# Altium project dog_robot.PrjPcb
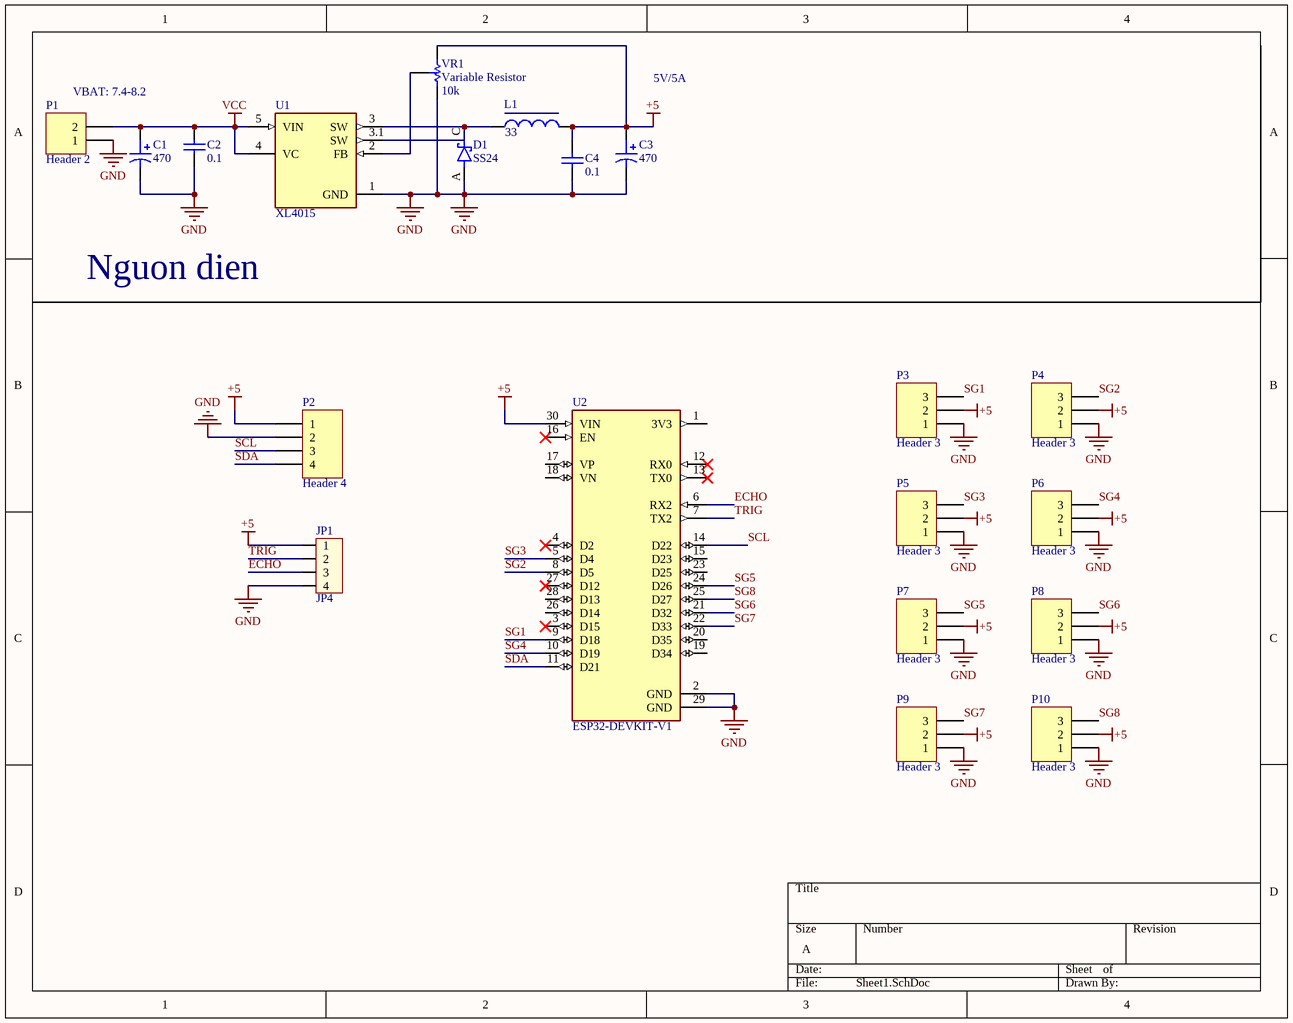
[diagram p0: Sheet1.SchDoc]
1 sheet, 20 parts. Net scope: global (net labels, ports and power ports of the same name join across sheets).
Board file: PCB1.PcbDoc

## Sheet Sheet1.SchDoc
size A; SheetNumber: 1; SheetTotal: 1

### Parts
C1  value 470  [RADIAL E]  (hidden comment: Cap Pol)
C2  value 0.1  [C-NP-0805]  (hidden comment: Cap Non-pol)
C3  value 470  [RADIAL E]  (hidden comment: Cap Pol)
C4  value 0.1  [C-NP-0805]  (hidden comment: Cap Non-pol)
D1  SS24  [DIOM5336X265N]
JP1  JP4  [CON4]
L1  33  [Cuon day ferrite]
P1  Header 2  [TBlock 2]
P2  Header 4  [Header 4]
P3  Header 3  [Header 3]
P4  Header 3  [Header 3]
P5  Header 3  [Header 3]
P6  Header 3  [Header 3]
P7  Header 3  [Header 3]
P8  Header 3  [Header 3]
P9  Header 3  [Header 3]
P10  Header 3  [Header 3]
U1  XL4015  [CONV_XL4015]
U2  ESP32-DEVKIT-V1  [MODULE_ESP32_DEVKIT_V1]
VR1  Variable Resistor  value 10k  [VRes-R]

### Nets
+5: C3.1 C4.1 JP1.1 L1.2 P2.1 P3.2 P4.2 P5.2 P6.2 P7.2 P8.2 P9.2 P10.2 U2.30(VIN) VR1.1
GND: C1.2 C2.1 C3.2 C4.2 D1.A JP1.4 P1.1 P2.2 P3.1 P4.1 P5.1 P6.1 P7.1 P8.1 P9.1 P10.1 U1.1(GND) U2.2(GND) U2.29(GND) VR1.3
VCC: C1.1 C2.2 P1.2 U1.4(VC) U1.5(VIN)
ECHO: JP1.3 U2.6(RX2)
SCL: P2.3 U2.14(D22)
SDA: P2.4 U2.11(D21)
SG1: P3.3 U2.9(D18)
SG2: P4.3 U2.8(D5)
SG3: P5.3 U2.5(D4)
SG4: P6.3 U2.10(D19)
SG5: P7.3 U2.24(D26)
SG6: P8.3 U2.21(D32)
SG7: P9.3 U2.22(D33)
SG8: P10.3 U2.25(D27)
TRIG: JP1.2 U2.7(TX2)
NetD1_C: D1.C(K) L1.1 U1.3(SW) U1.3.1(SW)
NetU1_2: U1.2(FB) VR1.2

Not connected (* = marked no-connect by the designer): U2 1(3V3) 3(D15)* 4(D2)* 12(RX0)* 13(TX0)* 15(D23) 16(EN)* 17(VP) 18(VN) 19(D34) 20(D35) 23(D25) 26(D14) 27(D12)* 28(D13)

### Notes on the sheet
- VBAT: 7.4-8.2
- 5V/5A
- Nguon dien

### Library data of the parts
C1 C3 = Cap Pol: Polarized Capacitor; Published: 8-Jun-2000; LatestRevisionDate: 17-Jul-2002; LatestRevisionNote: Re-released for DXP Platform.; PackageReference: POLAR0.8; Publisher: Altium Limited
C2 C4 = Cap Non-pol: Non-polarized Capacitor; Published: 8-Jun-2000; LatestRevisionDate: 17-Jul-2002; LatestRevisionNote: Re-released for DXP Platform.; PackageReference: RAD-0.3; Publisher: Altium Limited
D1 = SS24: Diode Schottky 40V 2A Surface Mount DO-214AA (SMB); MF: ON Semiconductor; Package: DO-214AA ON Semiconductor; Price: None; Value: *; SnapEDA_Link: https://www.snapeda.com/parts/SS24/Onsemi/view-part/?ref=snap; MP: SS24; Availability: In Stock; Check_prices: https://www.snapeda.com/parts/SS24/Onsemi/view-part/?ref=eda
JP1 = Con4: Connector 4; Value: Connector 4
L1 = Inductor Ferrite: Cuon Cam L; Code_IEC: 1005; Vendor: Digikey; Published: 8-Jun-2000; LatestRevisionDate: 17-Jul-2002; LatestRevisionNote: Re-released for DXP Platform.; PackageReference: 0402-A; Publisher: Altium Limited; Code_JEITA: 0402; ComponentLink1Description: Digikey Part Link; ComponentLink2Description: Open Datasheet; ComponentLink2URL: H:\LIBRARY\LIBRARY.Datasheet\
P1 = Header 2: Header, 2-Pin; LatestRevisionDate: 17-Jul-2002; LatestRevisionNote: Re-released for DXP Platform.; Publisher: Altium Limited
P2 = Header 4: Header, 4-Pin; LatestRevisionDate: 17-Jul-2002; LatestRevisionNote: Re-released for DXP Platform.; Publisher: Altium Limited
P3-P10 = Header 3: Header, 3-Pin; LatestRevisionDate: 17-Jul-2002; LatestRevisionNote: Re-released for DXP Platform.; Publisher: Altium Limited
U1 = XL4015: 5A 180KHz 36V Buck DC to DC Converter; Price: None; MP: XL4015; Value: *; Availability: Unavailable; Package: None
U2 = ESP32-DEVKIT-V1: Dual core, Wi-Fi: 2.4 GHz up to 150 Mbits/s,BLE (Bluetooth Low Energy) and legacy Bluetooth, 32 bits, Up to 240 MHz; MF: Do it; Price: None; Availability: Not in stock; Package: None; MP: ESP32-DEVKIT-V1; Value: *; SnapEDA_Link: https://www.snapeda.com/parts/ESP32-DEVKIT-V1/Do+it/view-part/?ref=snap; Check_prices: https://www.snapeda.com/parts/ESP32-DEVKIT-V1/Do+it/view-part/?ref=eda
VR1 = Variable Resistor: Published: 8-Jun-2000; LatestRevisionDate: 17-Jul-2002; LatestRevisionNote: Re-released for DXP Platform.; PackageReference: AXIAL-0.3; Publisher: Altium Limited